# EAGLE design 32pinromtoflash - piggyback + 28pin (EAGLE 9.6.2)
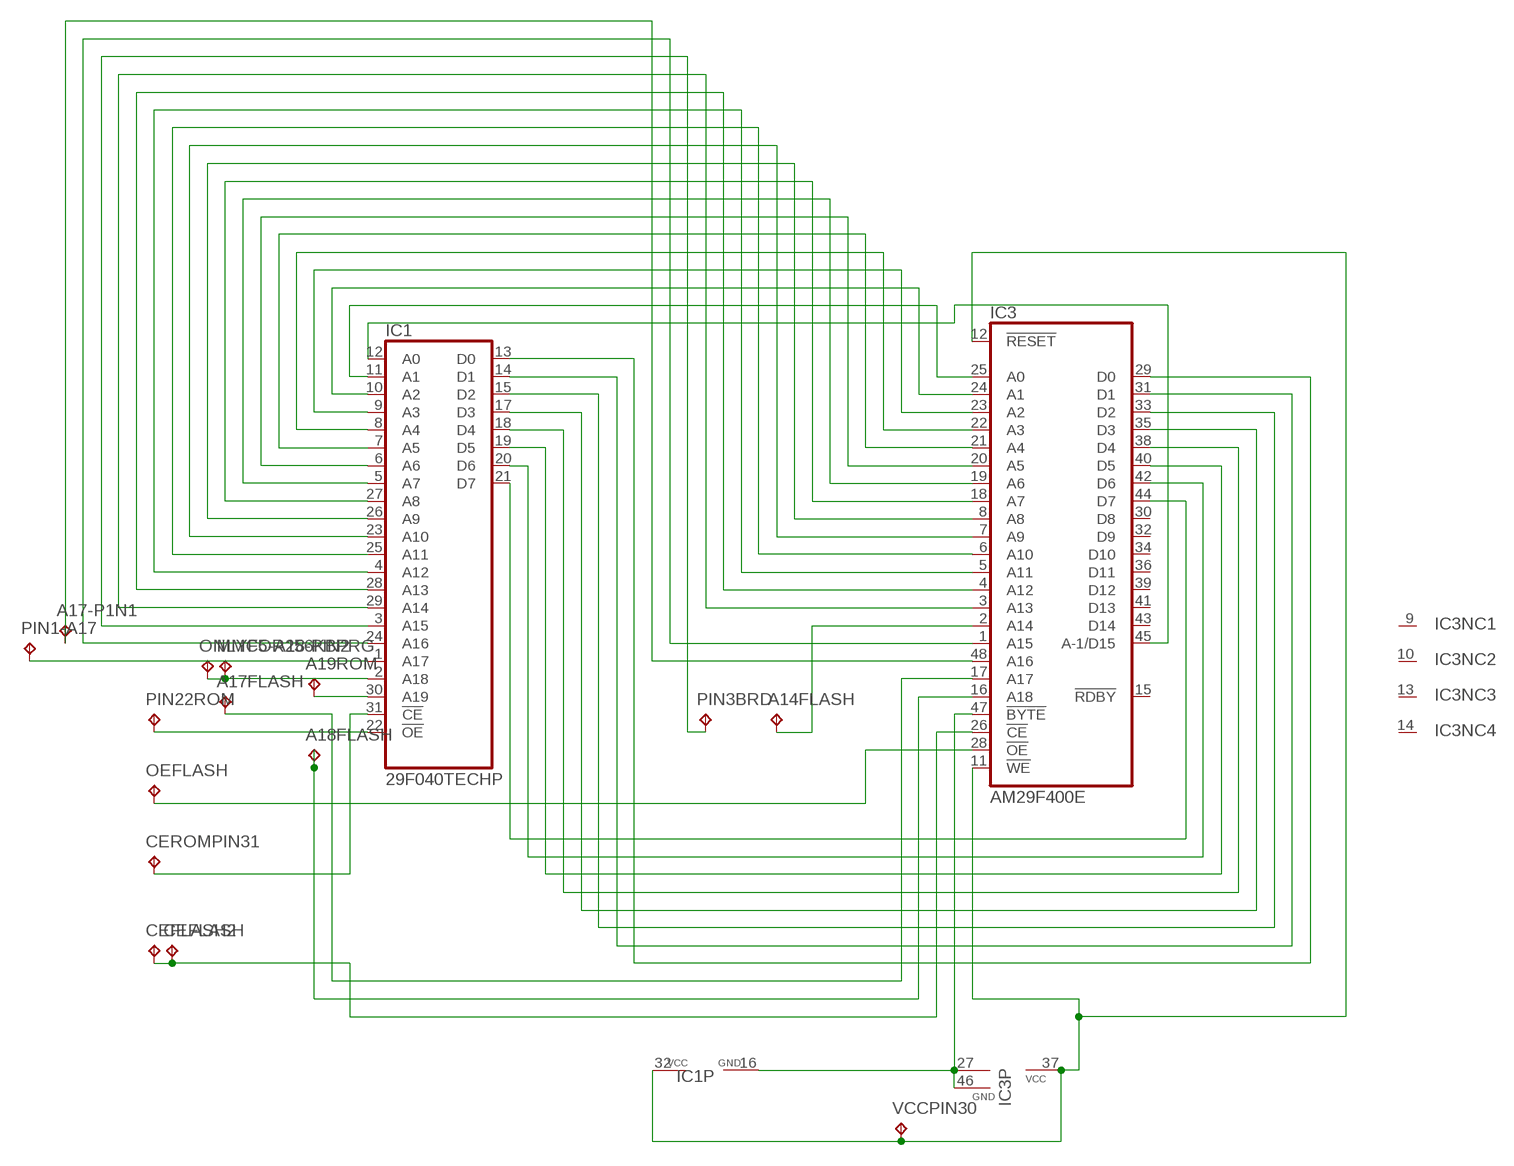
[diagram p0: schematic, sheet 1]

## Parts
A14FLASH  TPTP07SQ  [TP07SQ]
A17-P1N1  TPTP07SQ  [TP07SQ]
A17FLASH  TPTP07SQ  [TP07SQ]
A18FLASH  TPTP07SQ  [TP07SQ]
A19ROM  TPTP07SQ  [TP07SQ]
CEFLASH  TPTP07SQ  [TP07SQ]
CEFLASH2  TPTP07SQ  [TP07SQ]
CEROMPIN31  TPTP07SQ  [TP07SQ]
IC1  29F040TECHP  [DIL32-3]
IC3  AM29F400E  [TSOP48]
MMC5-A18-PIN2  TPTP07SQ  [TP07SQ]
OEFLASH  TPTP07SQ  [TP07SQ]
ONLYFOR256KBPRG  TPTP07SQ  [TP07SQ]
PIN1-A17  TPTP07SQ  [TP07SQ]
PIN3BRD  TPTP07SQ  [TP07SQ]
PIN22ROM  TPTP07SQ  [TP07SQ]
VCCPIN30  TPTP07SQ  [TP07SQ]

## Nets
A14FLASH: A14FLASH.TP IC3.2(A14)
A17FLASH: A17FLASH.TP IC3.17(A17)
A17PIN1ROM: IC1.1(A17) PIN1-A17.TP
A18FLASH: A17-P1N1.TP IC3.48(A16)
CEFLASH: CEFLASH2.TP CEFLASH.TP IC3.26(!CE)
CEROMPIN31: CEROMPIN31.TP IC1.31(!CE)
FLASH-A18: A18FLASH.TP IC3.16(A18)
MMC5-A0: IC1.12(A0) IC3.45(A-1/D15)
MMC5-A1: IC1.11(A1) IC3.25(A0)
MMC5-A2: IC1.10(A2) IC3.24(A1)
MMC5-A3: IC1.9(A3) IC3.23(A2)
MMC5-A4: IC1.8(A4) IC3.22(A3)
MMC5-A5: IC1.7(A5) IC3.21(A4)
MMC5-A6: IC1.6(A6) IC3.20(A5)
MMC5-A7: IC1.5(A7) IC3.19(A6)
MMC5-A8: IC1.27(A8) IC3.18(A7)
MMC5-A9: IC1.26(A9) IC3.8(A8)
MMC5-A10: IC1.23(A10) IC3.7(A9)
MMC5-A11: IC1.25(A11) IC3.6(A10)
MMC5-A12: IC1.4(A12) IC3.5(A11)
MMC5-A13: IC1.28(A13) IC3.4(A12)
MMC5-A14: IC1.29(A14) IC3.3(A13)
MMC5-A15: IC1.3(A15) PIN3BRD.TP
MMC5-A16: IC1.24(A16) IC3.1(A15)
MMC5-A19: A19ROM.TP IC1.30(A19)
MMC5-D0: IC1.13(D0) IC3.29(D0)
MMC5-D1: IC1.14(D1) IC3.31(D1)
MMC5-D2: IC1.15(D2) IC3.33(D2)
MMC5-D3: IC1.17(D3) IC3.35(D3)
MMC5-D4: IC1.18(D4) IC3.38(D4)
MMC5-D5: IC1.19(D5) IC3.40(D5)
MMC5-D6: IC1.20(D6) IC3.42(D6)
MMC5-D7: IC1.21(D7) IC3.44(D7)
MMC5-VCC: IC1.32(VCC) IC3.11(!WE) IC3.12(!RESET) IC3.37(VCC) VCCPIN30.TP
MMC5-VSS: IC1.16(GND) IC3.27(GND) IC3.46(GND) IC3.47(!BYTE)
OEFLASH: IC3.28(!OE) OEFLASH.TP
PIN2ROM: IC1.2(A18) MMC5-A18-PIN2.TP ONLYFOR256KBPRG.TP
PIN22ROM: IC1.22(!OE) PIN22ROM.TP
Unconnected: IC3.9(NC) IC3.10(NC) IC3.13(NC) IC3.14(NC) IC3.15(!RDBY) IC3.30(D8) IC3.32(D9) IC3.34(D10) IC3.36(D11) IC3.39(D12) IC3.41(D13) IC3.43(D14)

## Library data of the parts
A14FLASH A17-P1N1 A17FLASH A18FLASH A19ROM CEFLASH CEFLASH2 CEROMPIN31 MMC5-A18-PIN2 OEFLASH ONLYFOR256KBPRG PIN1-A17 PIN3BRD PIN22ROM VCCPIN30 = testpad:TP: Test pad
IC1 = MMC5:29F040: mmc5 rom
IC3 = custom 8-megabit am29-memory:AM29F400E: 4-Megabit FLASH MEMORY (512 K x 8 bit/256 K x 16 bit) 5 V-only

## Board
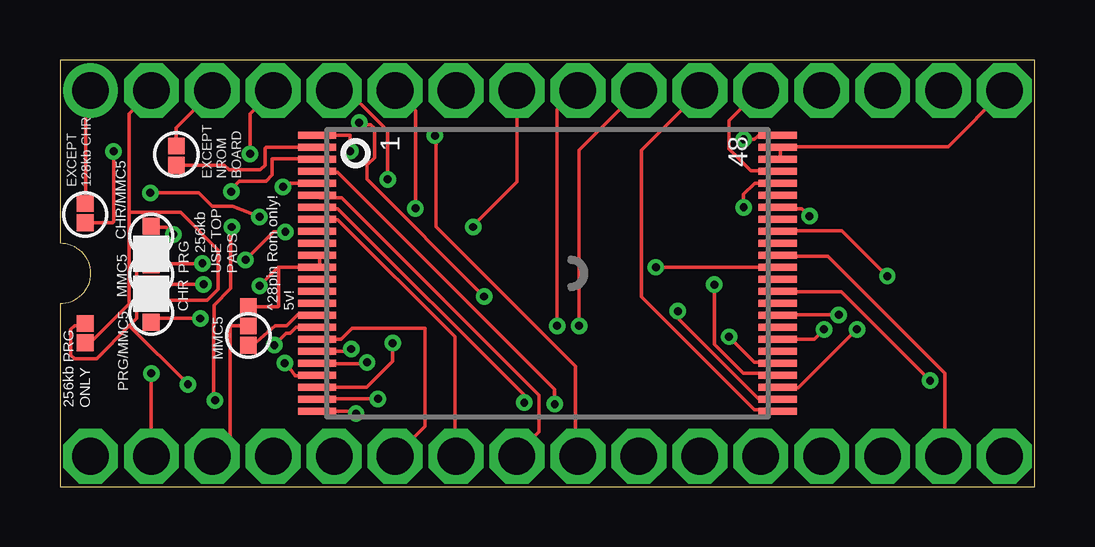
[diagram p1: board, top side]
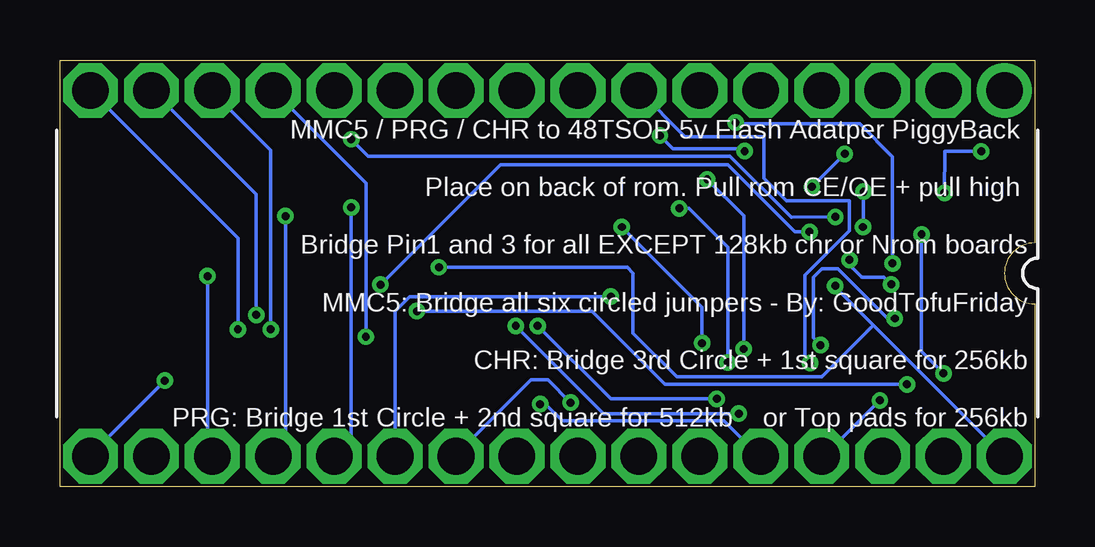
[diagram p2: board, bottom side, seen from below]

Size 40.64 x 17.78 mm. Coordinates in mm from the lower left corner, seen from the top.
Outline: 0,17.78 0,10.16 arc-180 0,7.62 0,0 40.64,0 40.64,17.78 0,17.78
Copper layers (1*16): Top 0.0356mm / dielectric 1.5011mm / Bottom 0.0356mm
Design rules "oshpark-2layer": minimum track width 6mil, minimum drill 13mil, track to track 6mil, track to pad 6mil, pad to pad 6mil, via to via 6mil, smd to smd 6mil, copper to edge 15mil, drill to drill 6mil, minimum pad ring 7mil, minimum via ring 7mil, stop-mask expansion 4mil, vias tented up to drill 0mil, thermal gap 10mil

### Footprints (pad centres in the part's own frame; a part is rotated, then mirrored left to right if it is on the bottom)
TP07SQ = smd 0.7 x 0.7: TP 0,0
DIL32-3 = drill 1.524 pad 1.905: 1 -19.05,-7.62 | drill 1.524 pad 1.905 octagon: 2 -16.51,-7.62; 3 -13.97,-7.62; 4 -11.43,-7.62; 5 -8.89,-7.62; 6 -6.35,-7.62; 7 -3.81,-7.62; 8 -1.27,-7.62; 9 1.27,-7.62; 10 3.81,-7.62; 11 6.35,-7.62; 12 8.89,-7.62; 13 11.43,-7.62; 14 13.97,-7.62; 15 16.51,-7.62; 16 19.05,-7.62; 17 19.05,7.62; 18 16.51,7.62; 19 13.97,7.62; 20 11.43,7.62; 21 8.89,7.62; 22 6.35,7.62; 23 3.81,7.62; 24 1.27,7.62; 25 -1.27,7.62; 26 -3.81,7.62; 27 -6.35,7.62; 28 -8.89,7.62; 29 -11.43,7.62; 30 -13.97,7.62; 31 -16.51,7.62; 32 -19.05,7.62
TSOP48 = smd 0.3 x 1.6: 1 -5.75,-9.6; 2 -5.25,-9.6; 3 -4.75,-9.6; 4 -4.25,-9.6; 5 -3.75,-9.6; 6 -3.25,-9.6; 7 -2.75,-9.6; 8 -2.25,-9.6; 9 -1.75,-9.6; 10 -1.25,-9.6; 11 -0.75,-9.6; 12 -0.25,-9.6; 13 0.25,-9.6; 14 0.75,-9.6; 15 1.25,-9.6; 16 1.75,-9.6; 17 2.25,-9.6; 18 2.75,-9.6; 19 3.25,-9.6; 20 3.75,-9.6; 21 4.25,-9.6; 22 4.75,-9.6; 23 5.25,-9.6; 24 5.75,-9.6; 25 5.75,9.6; 26 5.25,9.6; 27 4.75,9.6; 28 4.25,9.6; 29 3.75,9.6; 30 3.25,9.6; 31 2.75,9.6; 32 2.25,9.6; 33 1.75,9.6; 34 1.25,9.6; 35 0.75,9.6; 36 0.25,9.6; 37 -0.25,9.6; 38 -0.75,9.6; 39 -1.25,9.6; 40 -1.75,9.6; 41 -2.25,9.6; 42 -2.75,9.6; 43 -3.25,9.6; 44 -3.75,9.6; 45 -4.25,9.6; 46 -4.75,9.6; 47 -5.25,9.6; 48 -5.75,9.6

### Placement (x,y rotation side)
A14FLASH  4.85,13.4 0 top
A17-P1N1  1.05,11 0 top
A17FLASH  3.8,6.85 0 top
A18FLASH  7.85,5.9 0 top
A19ROM  7.85,6.7 0 top
CEFLASH  3.8,10.05 0 top
CEFLASH2  1.05,6.8 0 top
CEROMPIN31  3.8,10.85 0 top
IC1  20.32,8.89 180 bottom
IC3  20.32,8.89 270 top
MMC5-A18-PIN2  3.8,7.65 0 top
OEFLASH  3.8,8.45 0 top
ONLYFOR256KBPRG  1.05,6 0 top
PIN1-A17  1.05,11.8 0 top
PIN3BRD  4.85,14.2 0 top
PIN22ROM  3.8,9.25 0 top
VCCPIN30  7.85,7.5 0 top

### Tracks (layer width: path | path; a pad name or v marks a point on that pad's centre or on a via)
A14FLASH
  Top 0.152: A14FLASH.TP 6.85,13.4 7.04,13.21 | 7.05,13.21 7.04,13.21 | 7.04,13.21 7.05,13.2 8.35,13.2 8.54,13.39 8.54,14.1 8.59,14.14 IC3.2
A17FLASH  (via drill 0.33)
  Top 0.152: 3.81,6.81 3.8,6.82 A17FLASH.TP | 10.67,6.66 IC3.17 10.71,6.65 9.85,6.65 9.6,6.4 9.44,6.4 v8.94,5.9 | A17FLASH.TP 3.81,6.96 3.81,6.66 | v5.85,7.01 3.81,7.01 A17FLASH.TP
  Bottom 0.152: v5.85,7.01 6.15,7.01 8.22,9.08 8.88,9.08 9.24,8.72 9.24,6.2 v8.94,5.9
A17PIN1ROM
  Top 0.152: 1.17,11.68 PIN1-A17.TP 1.07,11.89 1.07,16.31 IC1.1
A18FLASH  (via drill 0.33)
  Top 0.152: 29.91,14.65 IC3.48 29.87,14.63 29.11,14.63 28.96,14.48 v28.5,14.48 | v8.32,11.25 7.2,11.68 6.35,11.68 5.79,12.25 v3.77,12.25 | v2.24,13.97 2.24,11.04 2.2,11 A17-P1N1.TP
  Bottom 0.152: v3.77,12.25 3.75,13.97 v2.24,13.97 | v8.32,11.25 10.16,11.22 12.7,13.77 27.79,13.77 v28.5,14.48
CEFLASH  (via drill 0.33)
  Top 0.152: 29.45,3.66 29.47,3.64 IC3.26 29.41,3.66 29.11,3.66 25.76,7.01 v25.76,7.32 | 3.55,10.05 CEFLASH.TP 3.5,10.06 3.2,9.75 3.2,7.01 2.9,6.71 | 2.9,6.71 1.52,5.33 0.61,5.33 0.46,5.49 0.46,6.55 0.61,6.71 0.91,6.71 CEFLASH2.TP | 2.9,6.71 v5.33,4.27
  Bottom 0.152: v25.76,7.32 18.46,7.32 15.41,4.27 v5.33,4.27
CEROMPIN31  (via drill 0.33)
  Top 0.152: CEROMPIN31.TP 3.81,10.82 4.42,10.82 v4.72,10.52 | IC1.31 v3.81,4.72
  Bottom 0.152: v4.72,10.52 4.72,5.64 v3.81,4.72
FLASH-A18
  Top 0.152: 7.85,5.7 A18FLASH.TP 8.03,5.9 8.97,6.71 9.45,6.71 9.91,7.16 10.67,7.16 IC3.16 10.64,7.14
MMC5-A0
  Top 0.152: 30.02,13.11 IC3.45 | 29.84,13.18 IC3.45 | IC3.45 29.91,13.16 28.8,13.16 27.89,14.07 27.89,15.24 29.11,16.46 IC1.12
MMC5-A1
  Top 0.152: IC3.25 29.87,3.2 28.96,3.2 24.23,7.92 24.23,14.02 26.67,16.46 IC1.11
MMC5-A2  (via drill 0.33)
  Top 0.152: 10.67,3.2 IC3.24 | 10.77,3.09 IC3.24 | v12.34,3.05 12.24,3.15 IC3.24 | v21.64,6.71 21.64,14.02 IC1.10
  Bottom 0.152: v12.34,3.05 17.98,3.05 v21.64,6.71
MMC5-A3  (via drill 0.33)
  Top 0.152: 10.82,3.66 IC3.23 | 11.13,3.7 IC3.23 | v13.26,3.66 11.12,3.66 IC3.23 | v20.73,6.71 20.73,15.7 21.49,16.46 IC1.9
  Bottom 0.152: v13.26,3.66 17.68,3.66 v20.73,6.71
MMC5-A4  (via drill 0.33)
  Top 0.152: 10.82,4.12 IC3.22 | IC3.22 10.79,4.13 | IC3.22 12.79,4.14 13.87,5.22 v13.87,5.99 | IC1.8 19.05,12.7 17.2,10.85 | 17.2,10.85 17.15,10.8 | v17.22,10.82 17.2,10.85
  Bottom 0.152: v13.87,5.99 13.87,7.47 v17.22,10.82
MMC5-A5  (via drill 0.33)
  Top 0.152: 10.9,4.55 IC3.21 10.7,4.62 9.8,4.62 9.42,5.15 v9.37,5.15
  Bottom 0.152: v9.37,5.15 9.6,5.48 9.6,8.8 7.74,10.66 7.74,11.92 10.37,11.92 11.3,12.85 11.3,14.59 14.59,14.59 IC1.7
MMC5-A6  (via drill 0.33)
  Top 0.152: 10.76,5.18 IC3.20 10.73,5.13 12.75,5.13 v12.8,5.18 | v14.82,11.6 14.82,15.66 IC1.6
  Bottom 0.152: v12.8,5.18 12.8,9.98 14.42,11.6 v14.82,11.6
MMC5-A7  (via drill 0.33)
  Top 0.152: 10.67,5.64 IC3.19 10.82,5.64 12.04,5.64 v12.14,5.74 | v13.66,12.81 13.66,14.84 12.04,16.46 11.43,16.46 IC1.5
  Bottom 0.152: v12.14,5.74 12.14,11.29 v13.66,12.81
MMC5-A8
  Top 0.152: 10.79,6.19 IC3.18 11.72,6.14 12.18,6.6 15.22,6.6 15.22,2.52 IC1.27
MMC5-A9
  Top 0.152: IC3.8 10.82,11.12 11.58,11.12 16.46,6.25 16.46,1.37 IC1.26
MMC5-A10  (via drill 0.33)
  Top 0.152: 10.67,11.58 IC3.7 10.82,11.58 11.58,11.58 19.36,3.81 v19.36,3.5
  Bottom 0.152: v19.36,3.5 20.3,4.46 21,4.46 24.08,1.37 IC1.23
MMC5-A11
  Top 0.152: 10.82,12.19 IC3.6 | 10.79,12.22 IC3.6 | IC3.6 10.82,12.04 11.73,12.04 19.96,3.81 19.96,2.29 19.05,1.37 IC1.25
MMC5-A12  (via drill 0.33)
  Top 0.152: v9.3,12.5 9.45,12.65 10.67,12.65 IC3.5 | v7.92,13.87 7.92,15.54 IC1.4
  Bottom 0.152: v7.92,13.87 v9.3,12.5
MMC5-A13  (via drill 0.33)
  Top 0.152: 10.79,13.18 IC3.4 10.82,13.11 11.58,13.11 20.62,4.07 v20.62,3.44
  Bottom 0.152: IC1.28 11.43,1.22 12.95,2.74 19.7,2.74 20.46,3.5 20.6,3.5 20.6,3.47 v20.62,3.44
MMC5-A14  (via drill 0.33)
  Top 0.152: 10.64,13.65 IC3.3 10.7,13.66 8.85,13.66 8.85,13 8.59,12.74 7.46,12.74 7.14,12.4 v7.14,12.29 | v6.46,3.6 6.41,3.65 6.41,6.76 6.42,6.77 6.42,7.57 7.11,8.26 7.11,10.77 v7.16,10.82
  Bottom 0.152: v7.16,10.82 7.14,10.84 v7.14,12.29 | IC1.29 8.79,1.27 v6.46,3.6
MMC5-A15
  Top 0.152: PIN3BRD.TP 4.85,14.95 6.35,16.45 IC1.3
MMC5-A16  (via drill 0.33)
  Top 0.152: v12.1,13.98 12.1,14.64 IC3.1 | v15.63,14.63 15.68,14.58 15.68,10.84 21.49,5.03 21.49,1.37 IC1.24
  Bottom 0.152: v15.63,14.63 15.08,14.08 12.2,14.08 v12.1,13.98
MMC5-A19
  Top 0.152: 7.77,6.68 A19ROM.TP 7.15,6.7 7.09,6.64 7.09,2.06 6.4,1.37 IC1.30
MMC5-D0  (via drill 0.33)
  Top 0.152: 30.52,5.1 30.5,5.08 30,5.08 IC3.29 29.87,5.18 28.96,5.18 v27.89,6.25
  Bottom 0.152: v27.89,6.25 27.89,12.65 IC1.13
MMC5-D1  (via drill 0.33)
  Top 0.152: v31.85,6.55 31.45,6.15 IC3.31
  Bottom 0.152: v31.85,6.55 31.85,14.02 34.29,16.46 IC1.14
MMC5-D2  (via drill 0.33)
  Top 0.152: 29.87,7.16 IC3.33 | 30,7.14 IC3.33 | v32.46,7.16 30.02,7.16 IC3.33
  Bottom 0.152: v32.46,7.16 32.46,12.19 36.73,16.46 IC1.15
MMC5-D3  (via drill 0.33)
  Top 0.152: v36.27,4.42 32.56,8.13 29.94,8.13 IC3.35
  Bottom 0.152: v36.27,4.42 39.32,1.37 IC1.17
MMC5-D4
  Top 0.152: 30,9.68 IC3.38 30.02,9.6 32,9.6 36.52,5.08 36.53,5.08 36.88,4.72 36.88,1.37 IC1.18
MMC5-D5  (via drill 0.33)
  Top 0.152: 29.87,10.67 IC3.40 | IC3.40 30,10.64 | v34.49,8.78 32.6,10.67 30.02,10.67 IC3.40
  Bottom 0.152: v34.49,8.78 34.49,1.47 IC1.19
MMC5-D6  (via drill 0.33)
  Top 0.152: 29.87,11.58 IC3.42 30.02,11.58 30.94,11.58 v31.24,11.28
  Bottom 0.152: v31.24,11.28 31.24,1.83 31.7,1.37 IC1.20
MMC5-D7  (via drill 0.33)
  Top 0.152: 30,12.7 IC3.44 29.87,12.65 28.96,12.65 28.5,12.19 v28.5,11.64
  Bottom 0.152: v28.5,11.64 28.5,1.98 IC1.21
MMC5-VCC  (via drill 0.33)
  Top 0.152: 10.79,9.21 IC3.12 | 29.84,9.21 IC3.37 29.87,9.14 v24.84,9.14 | IC3.12 | IC3.11 10.79,9.56 | IC3.12 11.39,9.14 | IC3.11 | IC3.12 10.82,9.14 10.82,9.6 IC3.11 | 9.12,9.14 9.09,9.14 v8.32,8.37 | 9.12,9.14 10.67,9.14 IC3.12 | VCCPIN30.TP 9.1,7.5 9.12,7.52 9.12,9.14
  Bottom 0.152: 6.73,6.73 8.89,4.57 14.92,4.57 16.75,6.4 16.75,8.9 16.99,9.14 v24.84,9.14 | IC1.32 6.73,6.73 | 6.73,6.73 8.38,8.38 v8.32,8.37
MMC5-VSS  (via drill 0.33)
  Top 0.152: 30,13.65 IC3.46 30.02,13.72 30.02,14.02 IC3.47 | 30,14.13 IC3.47 | 30,4.13 IC3.27 30.02,4.12 30.79,4.12 v33.22,6.55 | IC3.47 | IC1.16 37.03,14.17 30.02,14.17 IC3.47
  Bottom 0.152: v33.22,6.55 33.22,10.36 IC1.16
OEFLASH  (via drill 0.33)
  Top 0.152: 3.91,8.56 OEFLASH.TP 3.82,8.43 v5.99,8.43 | v9.4,10.62 8.9,10.62 v7.73,9.45 | v27.28,8.42 27.28,5.94 28.5,4.72 29.87,4.72 IC3.28
  Bottom 0.152: v5.99,8.43 6.29,8.73 7.21,8.73 7.73,9.25 v7.73,9.45 | v9.4,10.62 10.01,10.62 12.81,13.42 22.28,13.42 v27.28,8.42
PIN2ROM
  Top 0.152: 2.9,11.43 2.9,15.54 3.81,16.46 IC1.2 | 2.9,11.43 2.9,7.62 1.37,6.1 1.07,6.1 ONLYFOR256KBPRG.TP | 2.9,11.43 5.03,11.43 6.6,9.86 6.6,8.23 6.14,7.77 3.81,7.77 MMC5-A18-PIN2.TP
PIN22ROM  (via drill 0.33)
  Top 0.152: v5.94,9.31 5.79,9.31 5.8,9.3 3.81,9.3 PIN22ROM.TP | v12.47,15.17 12.56,15.09 12.95,15.09 13.11,14.94 13.11,13.72 12.8,13.41 12.8,12.8 v17.68,7.92
  Bottom 0.152: v5.94,9.31 5.94,13.76 7.3,15.12 12.43,15.12 v12.47,15.17 | v17.68,7.92 26.06,7.92 26.67,7.32 IC1.22

### Text on the board
tNames: EXCEPT / NROM / BOARD | EXCEPT / 128kb CHR | CHR/MMC5 | PRG / 256kb / USE TOP / PADS | MMC5 | CHR | ^28pin Rom only! / 5v! | MMC5 | PRG/MMC5 | 256kb PRG / ONLY
bNames: MMC5 / PRG / CHR to 48TSOP 5v Flash Adatper PiggyBack / / Place on back of rom. Pull rom CE/OE + pull high / / Bridge Pin1 and 3 for all EXCEPT 128kb chr or Nrom boards / / MMC5: Bridge all six circled jumpers - By: GoodTofuFriday / / CHR: Bridge 3rd Circle + 1st square for 256kb / / PRG: Bridge 1st Circle + 2nd square for 512kb or Top pads for 256kb